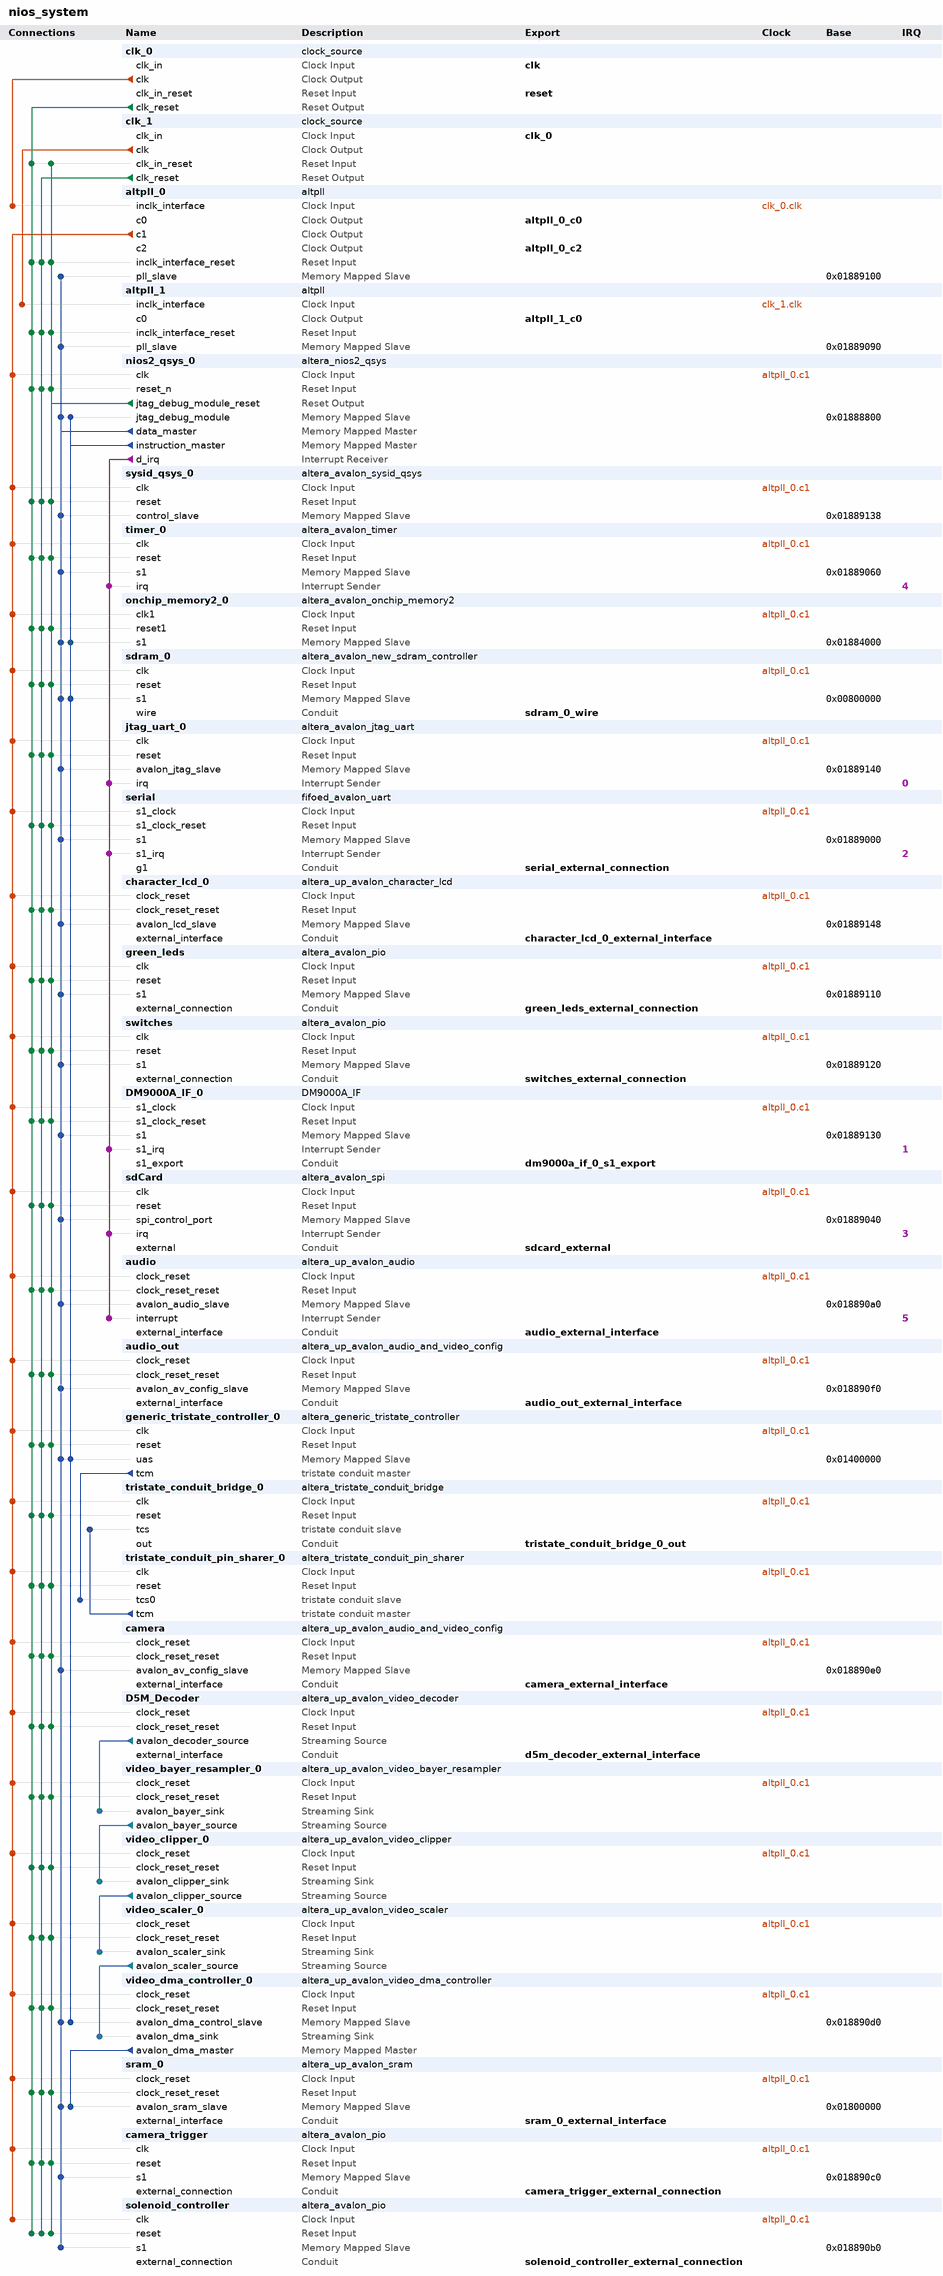
[diagram p0: system contents]
# Platform Designer (Qsys) system nios_system, Cyclone II EP2C35F672C6
# Parameters at their usual value, and those the tool derives, are not listed.
package require -exact qsys 12.1
create_system nios_system
set_project_property DEVICE_FAMILY {Cyclone II}
set_project_property DEVICE EP2C35F672C6

add_instance clk_0 clock_source 12.1
set_instance_parameter_value clk_0 clockFrequency 50000000

add_instance clk_1 clock_source 12.1
set_instance_parameter_value clk_1 clockFrequency 27000000

add_instance altpll_0 altpll 12.1
set_instance_parameter_value altpll_0 INCLK0_INPUT_FREQUENCY 20000
set_instance_parameter_value altpll_0 GATE_LOCK_SIGNAL NO
set_instance_parameter_value altpll_0 VALID_LOCK_MULTIPLIER 1
set_instance_parameter_value altpll_0 INVALID_LOCK_MULTIPLIER 5
set_instance_parameter_value altpll_0 CLK0_MULTIPLY_BY 1
set_instance_parameter_value altpll_0 CLK1_MULTIPLY_BY 1
set_instance_parameter_value altpll_0 CLK2_MULTIPLY_BY 1
set_instance_parameter_value altpll_0 CLK0_DIVIDE_BY 1
set_instance_parameter_value altpll_0 CLK1_DIVIDE_BY 1
set_instance_parameter_value altpll_0 CLK2_DIVIDE_BY 2
set_instance_parameter_value altpll_0 CLK0_PHASE_SHIFT -167
set_instance_parameter_value altpll_0 CLK1_PHASE_SHIFT 0
set_instance_parameter_value altpll_0 CLK2_PHASE_SHIFT 0
set_instance_parameter_value altpll_0 CLK1_DUTY_CYCLE 50
set_instance_parameter_value altpll_0 CLK2_DUTY_CYCLE 50
set_instance_parameter_value altpll_0 PORT_clk1 PORT_USED
set_instance_parameter_value altpll_0 PORT_clk2 PORT_USED
set_instance_parameter_value altpll_0 PORT_clk3 PORT_UNUSED
set_instance_parameter_value altpll_0 PORT_ARESET PORT_UNUSED
set_instance_parameter_value altpll_0 PORT_LOCKED PORT_UNUSED

add_instance altpll_1 altpll 12.1
set_instance_parameter_value altpll_1 INCLK0_INPUT_FREQUENCY 37037
set_instance_parameter_value altpll_1 GATE_LOCK_SIGNAL NO
set_instance_parameter_value altpll_1 VALID_LOCK_MULTIPLIER 1
set_instance_parameter_value altpll_1 INVALID_LOCK_MULTIPLIER 5
set_instance_parameter_value altpll_1 CLK0_MULTIPLY_BY 1019
set_instance_parameter_value altpll_1 CLK0_DIVIDE_BY 2250
set_instance_parameter_value altpll_1 PORT_clk1 PORT_UNUSED
set_instance_parameter_value altpll_1 PORT_clk2 PORT_UNUSED
set_instance_parameter_value altpll_1 PORT_clk3 PORT_UNUSED
set_instance_parameter_value altpll_1 PORT_ARESET PORT_USED
set_instance_parameter_value altpll_1 PORT_LOCKED PORT_USED

add_instance nios2_qsys_0 altera_nios2_qsys 12.1
set_instance_parameter_value nios2_qsys_0 resetSlave generic_tristate_controller_0.uas
set_instance_parameter_value nios2_qsys_0 exceptionSlave onchip_memory2_0.s1
set_instance_parameter_value nios2_qsys_0 breakSlave nios2_qsys_0.jtag_debug_module
set_instance_parameter_value nios2_qsys_0 impl Fast
set_instance_parameter_value nios2_qsys_0 icache_size 4096

add_instance sysid_qsys_0 altera_avalon_sysid_qsys 12.1
set_instance_parameter_value sysid_qsys_0 id 305419896

add_instance timer_0 altera_avalon_timer 12.1
set_instance_parameter_value timer_0 period 1
set_instance_parameter_value timer_0 periodUnits MSEC
set_instance_parameter_value timer_0 timerPreset CUSTOM

add_instance onchip_memory2_0 altera_avalon_onchip_memory2 12.1
set_instance_parameter_value onchip_memory2_0 dataWidth 32
set_instance_parameter_value onchip_memory2_0 dualPort false
set_instance_parameter_value onchip_memory2_0 initMemContent true
set_instance_parameter_value onchip_memory2_0 initializationFileName onchip_memory2_0
set_instance_parameter_value onchip_memory2_0 memorySize 16384

add_instance sdram_0 altera_avalon_new_sdram_controller 12.1
set_instance_parameter_value sdram_0 TAC 5.5
set_instance_parameter_value sdram_0 TRCD 20.0
set_instance_parameter_value sdram_0 TRP 20.0
set_instance_parameter_value sdram_0 casLatency 3
set_instance_parameter_value sdram_0 columnWidth 8
set_instance_parameter_value sdram_0 dataWidth 16
set_instance_parameter_value sdram_0 generateSimulationModel false
set_instance_parameter_value sdram_0 model custom
set_instance_parameter_value sdram_0 numberOfBanks 4
set_instance_parameter_value sdram_0 numberOfChipSelects 1
set_instance_parameter_value sdram_0 powerUpDelay 100.0
set_instance_parameter_value sdram_0 refreshPeriod 15.625
set_instance_parameter_value sdram_0 rowWidth 12

add_instance jtag_uart_0 altera_avalon_jtag_uart 12.1
set_instance_parameter_value jtag_uart_0 simInteractiveOptions INTERACTIVE_INPUT_OUTPUT

add_instance serial fifoed_avalon_uart 9.3.0
set_instance_parameter_value serial clock_freq 50000000
set_instance_parameter_value serial baud 57600
set_instance_parameter_value serial data_bits 8
set_instance_parameter_value serial fixed_baud true
set_instance_parameter_value serial parity N
set_instance_parameter_value serial stop_bits 1
set_instance_parameter_value serial use_cts_rts false
set_instance_parameter_value serial use_eop_register false
set_instance_parameter_value serial sim_true_baud 0
set_instance_parameter_value serial sim_char_stream DEADBEEF
set_instance_parameter_value serial use_tx_fifo true
set_instance_parameter_value serial fifo_size_tx 256
set_instance_parameter_value serial tx_fifo_LE false
set_instance_parameter_value serial tx_IRQ_Threshold 1
set_instance_parameter_value serial use_rx_fifo true
set_instance_parameter_value serial fifo_size_rx 512
set_instance_parameter_value serial rx_fifo_LE false
set_instance_parameter_value serial rx_IRQ_Threshold 1
set_instance_parameter_value serial fifo_export_used false
set_instance_parameter_value serial Has_IRQ true
set_instance_parameter_value serial hw_cts false
set_instance_parameter_value serial trans_pin false
set_instance_parameter_value serial use_timout false
set_instance_parameter_value serial timeout_value 4
set_instance_parameter_value serial use_gap_detection false
set_instance_parameter_value serial gap_value 4
set_instance_parameter_value serial use_timestamp false
set_instance_parameter_value serial use_ext_timestamp false
set_instance_parameter_value serial timestamp_width 8
set_instance_parameter_value serial add_error_bits false
set_instance_parameter_value serial driver_pass_error_bits false

add_instance character_lcd_0 altera_up_avalon_character_lcd 12.0
set_instance_parameter_value character_lcd_0 cursor Normal

add_instance green_leds altera_avalon_pio 12.1
set_instance_parameter_value green_leds direction Output
set_instance_parameter_value green_leds width 8

add_instance switches altera_avalon_pio 12.1
set_instance_parameter_value switches direction Input
set_instance_parameter_value switches width 16

add_instance DM9000A_IF_0 DM9000A_IF 1.0

add_instance sdCard altera_avalon_spi 12.1
set_instance_parameter_value sdCard clockPolarity 0
set_instance_parameter_value sdCard dataWidth 8
set_instance_parameter_value sdCard masterSPI true
set_instance_parameter_value sdCard numberOfSlaves 1
set_instance_parameter_value sdCard targetClockRate 128000

add_instance audio altera_up_avalon_audio 12.0
set_instance_parameter_value audio avalon_bus_type {Memory Mapped}
set_instance_parameter_value audio audio_in false
set_instance_parameter_value audio dw 32

add_instance audio_out altera_up_avalon_audio_and_video_config 12.0
set_instance_parameter_value audio_out board DE2
set_instance_parameter_value audio_out audio_in {Line In to ADC}
set_instance_parameter_value audio_out line_in_bypass false
set_instance_parameter_value audio_out bit_length 32
set_instance_parameter_value audio_out sampling_rate {48 kHz}

add_instance generic_tristate_controller_0 altera_generic_tristate_controller 12.1
set_instance_parameter_value generic_tristate_controller_0 TCM_ADDRESS_W 22
set_instance_parameter_value generic_tristate_controller_0 TCM_DATA_W 8
set_instance_parameter_value generic_tristate_controller_0 TCM_BYTEENABLE_W 1
set_instance_parameter_value generic_tristate_controller_0 TCM_READ_WAIT 160
set_instance_parameter_value generic_tristate_controller_0 TCM_WRITE_WAIT 160
set_instance_parameter_value generic_tristate_controller_0 TCM_SETUP_WAIT 40
set_instance_parameter_value generic_tristate_controller_0 TCM_DATA_HOLD 40
set_instance_parameter_value generic_tristate_controller_0 TCM_MAX_PENDING_READ_TRANSACTIONS 3
set_instance_parameter_value generic_tristate_controller_0 TCM_TURNAROUND_TIME 2
set_instance_parameter_value generic_tristate_controller_0 TCM_TIMING_UNITS 0
set_instance_parameter_value generic_tristate_controller_0 TCM_READLATENCY 2
set_instance_parameter_value generic_tristate_controller_0 TCM_SYMBOLS_PER_WORD 1
set_instance_parameter_value generic_tristate_controller_0 USE_READ 1
set_instance_parameter_value generic_tristate_controller_0 USE_BEGINTRANSFER 0
set_instance_parameter_value generic_tristate_controller_0 USE_BYTEENABLE 0
set_instance_parameter_value generic_tristate_controller_0 USE_OUTPUTENABLE 0
set_instance_parameter_value generic_tristate_controller_0 ACTIVE_LOW_READ 1
set_instance_parameter_value generic_tristate_controller_0 ACTIVE_LOW_BYTEENABLE 0
set_instance_parameter_value generic_tristate_controller_0 ACTIVE_LOW_OUTPUTENABLE 0
set_instance_parameter_value generic_tristate_controller_0 ACTIVE_LOW_BEGINTRANSFER 0
set_instance_parameter_value generic_tristate_controller_0 CHIPSELECT_THROUGH_READLATENCY 0
set_instance_parameter_value generic_tristate_controller_0 MODULE_ASSIGNMENT_KEYS embeddedsw.configuration.hwClassnameDriverSupportList,embeddedsw.configuration.isFlash,embeddedsw.configuration.isMemoryDevice,embeddedsw.configuration.isNonVolatileStorage
set_instance_parameter_value generic_tristate_controller_0 MODULE_ASSIGNMENT_VALUES "altera_avalon_lan91c111\\,altera_avalon_cfi_flash,1,1,1"
set_instance_parameter_value generic_tristate_controller_0 INTERFACE_ASSIGNMENT_KEYS embeddedsw.configuration.isFlash,embeddedsw.configuration.isMemoryDevice,embeddedsw.configuration.isNonVolatileStorage
set_instance_parameter_value generic_tristate_controller_0 INTERFACE_ASSIGNMENT_VALUES 1,1,1

add_instance tristate_conduit_bridge_0 altera_tristate_conduit_bridge 12.1

add_instance tristate_conduit_pin_sharer_0 altera_tristate_conduit_pin_sharer 12.1
set_instance_parameter_value tristate_conduit_pin_sharer_0 NUM_INTERFACES 1
set_instance_parameter_value tristate_conduit_pin_sharer_0 MODULE_ORIGIN_LIST generic_tristate_controller_0.tcm,generic_tristate_controller_0.tcm,generic_tristate_controller_0.tcm,generic_tristate_controller_0.tcm,generic_tristate_controller_0.tcm

add_instance camera altera_up_avalon_audio_and_video_config 12.0
set_instance_parameter_value camera board DE2
set_instance_parameter_value camera audio_in {Microphone to ADC}
set_instance_parameter_value camera line_in_bypass false
set_instance_parameter_value camera bit_length 24
set_instance_parameter_value camera sampling_rate {48 kHz}

add_instance D5M_Decoder altera_up_avalon_video_decoder 12.0
set_instance_parameter_value D5M_Decoder video_source {5MP Daughtercard (THDB_D5M)}

add_instance video_bayer_resampler_0 altera_up_avalon_video_bayer_resampler 12.0
set_instance_parameter_value video_bayer_resampler_0 use_custom_format true
set_instance_parameter_value video_bayer_resampler_0 custom_width_in 1024
set_instance_parameter_value video_bayer_resampler_0 custom_height_in 768

add_instance video_clipper_0 altera_up_avalon_video_clipper 12.0
set_instance_parameter_value video_clipper_0 width_in 1296
set_instance_parameter_value video_clipper_0 height_in 972
set_instance_parameter_value video_clipper_0 drop_left 8
set_instance_parameter_value video_clipper_0 drop_right 8
set_instance_parameter_value video_clipper_0 drop_top 6
set_instance_parameter_value video_clipper_0 drop_bottom 6
set_instance_parameter_value video_clipper_0 color_bits 8
set_instance_parameter_value video_clipper_0 color_planes 3

add_instance video_scaler_0 altera_up_avalon_video_scaler 12.0
set_instance_parameter_value video_scaler_0 width_scaling 0.25
set_instance_parameter_value video_scaler_0 height_scaling 0.25
set_instance_parameter_value video_scaler_0 width_in 1280
set_instance_parameter_value video_scaler_0 height_in 960
set_instance_parameter_value video_scaler_0 color_bits 8
set_instance_parameter_value video_scaler_0 color_planes 3

add_instance video_dma_controller_0 altera_up_avalon_video_dma_controller 12.0
set_instance_parameter_value video_dma_controller_0 mode {From Stream to Memory}
set_instance_parameter_value video_dma_controller_0 addr_mode Consecutive
set_instance_parameter_value video_dma_controller_0 start_address 0
set_instance_parameter_value video_dma_controller_0 back_start_address 0
set_instance_parameter_value video_dma_controller_0 width 320
set_instance_parameter_value video_dma_controller_0 height 240
set_instance_parameter_value video_dma_controller_0 color_bits 8
set_instance_parameter_value video_dma_controller_0 color_planes 3

add_instance sram_0 altera_up_avalon_sram 12.0
set_instance_parameter_value sram_0 board DE2
set_instance_parameter_value sram_0 pixel_buffer false

add_instance camera_trigger altera_avalon_pio 12.1
set_instance_parameter_value camera_trigger direction Output
set_instance_parameter_value camera_trigger width 1

add_instance solenoid_controller altera_avalon_pio 12.1
set_instance_parameter_value solenoid_controller direction Output
set_instance_parameter_value solenoid_controller width 1

# connections
add_connection altpll_0.c1 audio.clock_reset clock
add_connection altpll_0.c1 audio_out.clock_reset clock
add_connection altpll_0.c1 camera.clock_reset clock
add_connection altpll_0.c1 camera_trigger.clk clock
add_connection altpll_0.c1 character_lcd_0.clock_reset clock
add_connection altpll_0.c1 D5M_Decoder.clock_reset clock
add_connection altpll_0.c1 DM9000A_IF_0.s1_clock clock
add_connection altpll_0.c1 generic_tristate_controller_0.clk clock
add_connection altpll_0.c1 green_leds.clk clock
add_connection altpll_0.c1 jtag_uart_0.clk clock
add_connection altpll_0.c1 nios2_qsys_0.clk clock
add_connection altpll_0.c1 onchip_memory2_0.clk1 clock
add_connection altpll_0.c1 sdCard.clk clock
add_connection altpll_0.c1 sdram_0.clk clock
add_connection altpll_0.c1 serial.s1_clock clock
add_connection altpll_0.c1 solenoid_controller.clk clock
add_connection altpll_0.c1 sram_0.clock_reset clock
add_connection altpll_0.c1 switches.clk clock
add_connection altpll_0.c1 sysid_qsys_0.clk clock
add_connection altpll_0.c1 timer_0.clk clock
add_connection altpll_0.c1 tristate_conduit_bridge_0.clk clock
add_connection altpll_0.c1 tristate_conduit_pin_sharer_0.clk clock
add_connection altpll_0.c1 video_bayer_resampler_0.clock_reset clock
add_connection altpll_0.c1 video_clipper_0.clock_reset clock
add_connection altpll_0.c1 video_dma_controller_0.clock_reset clock
add_connection altpll_0.c1 video_scaler_0.clock_reset clock
add_connection clk_0.clk altpll_0.inclk_interface clock
add_connection clk_1.clk altpll_1.inclk_interface clock
add_connection clk_0.clk_reset altpll_0.inclk_interface_reset reset
add_connection clk_0.clk_reset altpll_1.inclk_interface_reset reset
add_connection clk_0.clk_reset audio.clock_reset_reset reset
add_connection clk_0.clk_reset audio_out.clock_reset_reset reset
add_connection clk_0.clk_reset camera.clock_reset_reset reset
add_connection clk_0.clk_reset camera_trigger.reset reset
add_connection clk_0.clk_reset character_lcd_0.clock_reset_reset reset
add_connection clk_0.clk_reset clk_1.clk_in_reset reset
add_connection clk_0.clk_reset D5M_Decoder.clock_reset_reset reset
add_connection clk_0.clk_reset DM9000A_IF_0.s1_clock_reset reset
add_connection clk_0.clk_reset generic_tristate_controller_0.reset reset
add_connection clk_0.clk_reset green_leds.reset reset
add_connection clk_0.clk_reset jtag_uart_0.reset reset
add_connection clk_0.clk_reset nios2_qsys_0.reset_n reset
add_connection clk_0.clk_reset onchip_memory2_0.reset1 reset
add_connection clk_0.clk_reset sdCard.reset reset
add_connection clk_0.clk_reset sdram_0.reset reset
add_connection clk_0.clk_reset serial.s1_clock_reset reset
add_connection clk_0.clk_reset solenoid_controller.reset reset
add_connection clk_0.clk_reset sram_0.clock_reset_reset reset
add_connection clk_0.clk_reset switches.reset reset
add_connection clk_0.clk_reset sysid_qsys_0.reset reset
add_connection clk_0.clk_reset timer_0.reset reset
add_connection clk_0.clk_reset tristate_conduit_bridge_0.reset reset
add_connection clk_0.clk_reset tristate_conduit_pin_sharer_0.reset reset
add_connection clk_0.clk_reset video_bayer_resampler_0.clock_reset_reset reset
add_connection clk_0.clk_reset video_clipper_0.clock_reset_reset reset
add_connection clk_0.clk_reset video_dma_controller_0.clock_reset_reset reset
add_connection clk_0.clk_reset video_scaler_0.clock_reset_reset reset
add_connection clk_1.clk_reset altpll_0.inclk_interface_reset reset
add_connection clk_1.clk_reset altpll_1.inclk_interface_reset reset
add_connection clk_1.clk_reset audio.clock_reset_reset reset
add_connection clk_1.clk_reset audio_out.clock_reset_reset reset
add_connection clk_1.clk_reset camera.clock_reset_reset reset
add_connection clk_1.clk_reset camera_trigger.reset reset
add_connection clk_1.clk_reset character_lcd_0.clock_reset_reset reset
add_connection clk_1.clk_reset D5M_Decoder.clock_reset_reset reset
add_connection clk_1.clk_reset DM9000A_IF_0.s1_clock_reset reset
add_connection clk_1.clk_reset generic_tristate_controller_0.reset reset
add_connection clk_1.clk_reset green_leds.reset reset
add_connection clk_1.clk_reset jtag_uart_0.reset reset
add_connection clk_1.clk_reset nios2_qsys_0.reset_n reset
add_connection clk_1.clk_reset onchip_memory2_0.reset1 reset
add_connection clk_1.clk_reset sdCard.reset reset
add_connection clk_1.clk_reset sdram_0.reset reset
add_connection clk_1.clk_reset serial.s1_clock_reset reset
add_connection clk_1.clk_reset solenoid_controller.reset reset
add_connection clk_1.clk_reset sram_0.clock_reset_reset reset
add_connection clk_1.clk_reset switches.reset reset
add_connection clk_1.clk_reset sysid_qsys_0.reset reset
add_connection clk_1.clk_reset timer_0.reset reset
add_connection clk_1.clk_reset tristate_conduit_bridge_0.reset reset
add_connection clk_1.clk_reset tristate_conduit_pin_sharer_0.reset reset
add_connection clk_1.clk_reset video_bayer_resampler_0.clock_reset_reset reset
add_connection clk_1.clk_reset video_clipper_0.clock_reset_reset reset
add_connection clk_1.clk_reset video_dma_controller_0.clock_reset_reset reset
add_connection clk_1.clk_reset video_scaler_0.clock_reset_reset reset
add_connection nios2_qsys_0.jtag_debug_module_reset altpll_0.inclk_interface_reset reset
add_connection nios2_qsys_0.jtag_debug_module_reset altpll_1.inclk_interface_reset reset
add_connection nios2_qsys_0.jtag_debug_module_reset audio.clock_reset_reset reset
add_connection nios2_qsys_0.jtag_debug_module_reset audio_out.clock_reset_reset reset
add_connection nios2_qsys_0.jtag_debug_module_reset camera.clock_reset_reset reset
add_connection nios2_qsys_0.jtag_debug_module_reset camera_trigger.reset reset
add_connection nios2_qsys_0.jtag_debug_module_reset character_lcd_0.clock_reset_reset reset
add_connection nios2_qsys_0.jtag_debug_module_reset clk_1.clk_in_reset reset
add_connection nios2_qsys_0.jtag_debug_module_reset D5M_Decoder.clock_reset_reset reset
add_connection nios2_qsys_0.jtag_debug_module_reset DM9000A_IF_0.s1_clock_reset reset
add_connection nios2_qsys_0.jtag_debug_module_reset generic_tristate_controller_0.reset reset
add_connection nios2_qsys_0.jtag_debug_module_reset green_leds.reset reset
add_connection nios2_qsys_0.jtag_debug_module_reset jtag_uart_0.reset reset
add_connection nios2_qsys_0.jtag_debug_module_reset nios2_qsys_0.reset_n reset
add_connection nios2_qsys_0.jtag_debug_module_reset onchip_memory2_0.reset1 reset
add_connection nios2_qsys_0.jtag_debug_module_reset sdCard.reset reset
add_connection nios2_qsys_0.jtag_debug_module_reset sdram_0.reset reset
add_connection nios2_qsys_0.jtag_debug_module_reset serial.s1_clock_reset reset
add_connection nios2_qsys_0.jtag_debug_module_reset solenoid_controller.reset reset
add_connection nios2_qsys_0.jtag_debug_module_reset sram_0.clock_reset_reset reset
add_connection nios2_qsys_0.jtag_debug_module_reset switches.reset reset
add_connection nios2_qsys_0.jtag_debug_module_reset sysid_qsys_0.reset reset
add_connection nios2_qsys_0.jtag_debug_module_reset timer_0.reset reset
add_connection nios2_qsys_0.jtag_debug_module_reset tristate_conduit_bridge_0.reset reset
add_connection nios2_qsys_0.jtag_debug_module_reset tristate_conduit_pin_sharer_0.reset reset
add_connection nios2_qsys_0.jtag_debug_module_reset video_bayer_resampler_0.clock_reset_reset reset
add_connection nios2_qsys_0.jtag_debug_module_reset video_clipper_0.clock_reset_reset reset
add_connection nios2_qsys_0.jtag_debug_module_reset video_dma_controller_0.clock_reset_reset reset
add_connection nios2_qsys_0.jtag_debug_module_reset video_scaler_0.clock_reset_reset reset
add_connection nios2_qsys_0.data_master altpll_0.pll_slave avalon
set_connection_parameter_value nios2_qsys_0.data_master/altpll_0.pll_slave baseAddress 0x01889100
add_connection nios2_qsys_0.data_master altpll_1.pll_slave avalon
set_connection_parameter_value nios2_qsys_0.data_master/altpll_1.pll_slave baseAddress 0x01889090
add_connection nios2_qsys_0.data_master audio.avalon_audio_slave avalon
set_connection_parameter_value nios2_qsys_0.data_master/audio.avalon_audio_slave baseAddress 0x018890a0
add_connection nios2_qsys_0.data_master audio_out.avalon_av_config_slave avalon
set_connection_parameter_value nios2_qsys_0.data_master/audio_out.avalon_av_config_slave baseAddress 0x018890f0
add_connection nios2_qsys_0.data_master camera.avalon_av_config_slave avalon
set_connection_parameter_value nios2_qsys_0.data_master/camera.avalon_av_config_slave baseAddress 0x018890e0
add_connection nios2_qsys_0.data_master camera_trigger.s1 avalon
set_connection_parameter_value nios2_qsys_0.data_master/camera_trigger.s1 baseAddress 0x018890c0
add_connection nios2_qsys_0.data_master character_lcd_0.avalon_lcd_slave avalon
set_connection_parameter_value nios2_qsys_0.data_master/character_lcd_0.avalon_lcd_slave baseAddress 0x01889148
add_connection nios2_qsys_0.data_master DM9000A_IF_0.s1 avalon
set_connection_parameter_value nios2_qsys_0.data_master/DM9000A_IF_0.s1 baseAddress 0x01889130
add_connection nios2_qsys_0.data_master generic_tristate_controller_0.uas avalon
set_connection_parameter_value nios2_qsys_0.data_master/generic_tristate_controller_0.uas baseAddress 0x01400000
add_connection nios2_qsys_0.data_master green_leds.s1 avalon
set_connection_parameter_value nios2_qsys_0.data_master/green_leds.s1 baseAddress 0x01889110
add_connection nios2_qsys_0.data_master jtag_uart_0.avalon_jtag_slave avalon
set_connection_parameter_value nios2_qsys_0.data_master/jtag_uart_0.avalon_jtag_slave baseAddress 0x01889140
add_connection nios2_qsys_0.data_master nios2_qsys_0.jtag_debug_module avalon
set_connection_parameter_value nios2_qsys_0.data_master/nios2_qsys_0.jtag_debug_module baseAddress 0x01888800
add_connection nios2_qsys_0.data_master onchip_memory2_0.s1 avalon
set_connection_parameter_value nios2_qsys_0.data_master/onchip_memory2_0.s1 baseAddress 0x01884000
add_connection nios2_qsys_0.data_master sdCard.spi_control_port avalon
set_connection_parameter_value nios2_qsys_0.data_master/sdCard.spi_control_port baseAddress 0x01889040
add_connection nios2_qsys_0.data_master sdram_0.s1 avalon
set_connection_parameter_value nios2_qsys_0.data_master/sdram_0.s1 baseAddress 0x00800000
add_connection nios2_qsys_0.data_master serial.s1 avalon
set_connection_parameter_value nios2_qsys_0.data_master/serial.s1 baseAddress 0x01889000
add_connection nios2_qsys_0.data_master solenoid_controller.s1 avalon
set_connection_parameter_value nios2_qsys_0.data_master/solenoid_controller.s1 baseAddress 0x018890b0
add_connection nios2_qsys_0.data_master sram_0.avalon_sram_slave avalon
set_connection_parameter_value nios2_qsys_0.data_master/sram_0.avalon_sram_slave baseAddress 0x01800000
add_connection nios2_qsys_0.data_master switches.s1 avalon
set_connection_parameter_value nios2_qsys_0.data_master/switches.s1 baseAddress 0x01889120
add_connection nios2_qsys_0.data_master sysid_qsys_0.control_slave avalon
set_connection_parameter_value nios2_qsys_0.data_master/sysid_qsys_0.control_slave baseAddress 0x01889138
add_connection nios2_qsys_0.data_master timer_0.s1 avalon
set_connection_parameter_value nios2_qsys_0.data_master/timer_0.s1 baseAddress 0x01889060
add_connection nios2_qsys_0.data_master video_dma_controller_0.avalon_dma_control_slave avalon
set_connection_parameter_value nios2_qsys_0.data_master/video_dma_controller_0.avalon_dma_control_slave baseAddress 0x018890d0
add_connection nios2_qsys_0.instruction_master generic_tristate_controller_0.uas avalon
set_connection_parameter_value nios2_qsys_0.instruction_master/generic_tristate_controller_0.uas baseAddress 0x01400000
add_connection nios2_qsys_0.instruction_master nios2_qsys_0.jtag_debug_module avalon
set_connection_parameter_value nios2_qsys_0.instruction_master/nios2_qsys_0.jtag_debug_module baseAddress 0x01888800
add_connection nios2_qsys_0.instruction_master onchip_memory2_0.s1 avalon
set_connection_parameter_value nios2_qsys_0.instruction_master/onchip_memory2_0.s1 baseAddress 0x01884000
add_connection nios2_qsys_0.instruction_master sdram_0.s1 avalon
set_connection_parameter_value nios2_qsys_0.instruction_master/sdram_0.s1 baseAddress 0x00800000
add_connection nios2_qsys_0.instruction_master video_dma_controller_0.avalon_dma_control_slave avalon
set_connection_parameter_value nios2_qsys_0.instruction_master/video_dma_controller_0.avalon_dma_control_slave baseAddress 0x018890d0
add_connection video_dma_controller_0.avalon_dma_master sram_0.avalon_sram_slave avalon
set_connection_parameter_value video_dma_controller_0.avalon_dma_master/sram_0.avalon_sram_slave baseAddress 0x01800000
add_connection D5M_Decoder.avalon_decoder_source video_bayer_resampler_0.avalon_bayer_sink avalon_streaming
add_connection video_bayer_resampler_0.avalon_bayer_source video_clipper_0.avalon_clipper_sink avalon_streaming
add_connection video_clipper_0.avalon_clipper_source video_scaler_0.avalon_scaler_sink avalon_streaming
add_connection video_scaler_0.avalon_scaler_source video_dma_controller_0.avalon_dma_sink avalon_streaming
add_connection nios2_qsys_0.d_irq audio.interrupt interrupt
set_connection_parameter_value nios2_qsys_0.d_irq/audio.interrupt irqNumber 5
add_connection nios2_qsys_0.d_irq DM9000A_IF_0.s1_irq interrupt
set_connection_parameter_value nios2_qsys_0.d_irq/DM9000A_IF_0.s1_irq irqNumber 1
add_connection nios2_qsys_0.d_irq jtag_uart_0.irq interrupt
set_connection_parameter_value nios2_qsys_0.d_irq/jtag_uart_0.irq irqNumber 0
add_connection nios2_qsys_0.d_irq sdCard.irq interrupt
set_connection_parameter_value nios2_qsys_0.d_irq/sdCard.irq irqNumber 3
add_connection nios2_qsys_0.d_irq serial.s1_irq interrupt
set_connection_parameter_value nios2_qsys_0.d_irq/serial.s1_irq irqNumber 2
add_connection nios2_qsys_0.d_irq timer_0.irq interrupt
set_connection_parameter_value nios2_qsys_0.d_irq/timer_0.irq irqNumber 4
add_connection generic_tristate_controller_0.tcm tristate_conduit_pin_sharer_0.tcs0 tristate_conduit
add_connection tristate_conduit_pin_sharer_0.tcm tristate_conduit_bridge_0.tcs tristate_conduit

# exported interfaces
add_interface reset reset sink
set_interface_property reset EXPORT_OF clk_0.clk_in_reset
add_interface switches_external_connection conduit end
set_interface_property switches_external_connection EXPORT_OF switches.external_connection
add_interface green_leds_external_connection conduit end
set_interface_property green_leds_external_connection EXPORT_OF green_leds.external_connection
add_interface character_lcd_0_external_interface conduit end
set_interface_property character_lcd_0_external_interface EXPORT_OF character_lcd_0.external_interface
add_interface sdram_0_wire conduit end
set_interface_property sdram_0_wire EXPORT_OF sdram_0.wire
add_interface clk clock sink
set_interface_property clk EXPORT_OF clk_0.clk_in
add_interface sram_0_external_interface conduit end
set_interface_property sram_0_external_interface EXPORT_OF sram_0.external_interface
add_interface altpll_0_c0 clock source
set_interface_property altpll_0_c0 EXPORT_OF altpll_0.c0
add_interface dm9000a_if_0_s1_export conduit end
set_interface_property dm9000a_if_0_s1_export EXPORT_OF DM9000A_IF_0.s1_export
add_interface tristate_conduit_bridge_0_out conduit end
set_interface_property tristate_conduit_bridge_0_out EXPORT_OF tristate_conduit_bridge_0.out
add_interface serial_external_connection conduit end
set_interface_property serial_external_connection EXPORT_OF serial.g1
add_interface sdcard_external conduit end
set_interface_property sdcard_external EXPORT_OF sdCard.external
add_interface audio_out_external_interface conduit end
set_interface_property audio_out_external_interface EXPORT_OF audio_out.external_interface
add_interface camera_external_interface conduit end
set_interface_property camera_external_interface EXPORT_OF camera.external_interface
add_interface d5m_decoder_external_interface conduit end
set_interface_property d5m_decoder_external_interface EXPORT_OF D5M_Decoder.external_interface
add_interface camera_trigger_external_connection conduit end
set_interface_property camera_trigger_external_connection EXPORT_OF camera_trigger.external_connection
add_interface solenoid_controller_external_connection conduit end
set_interface_property solenoid_controller_external_connection EXPORT_OF solenoid_controller.external_connection
add_interface audio_external_interface conduit end
set_interface_property audio_external_interface EXPORT_OF audio.external_interface
add_interface altpll_0_c2 clock source
set_interface_property altpll_0_c2 EXPORT_OF altpll_0.c2
add_interface clk_0 clock sink
set_interface_property clk_0 EXPORT_OF clk_1.clk_in
add_interface altpll_1_c0 clock source
set_interface_property altpll_1_c0 EXPORT_OF altpll_1.c0

save_system nios_system.qsys
